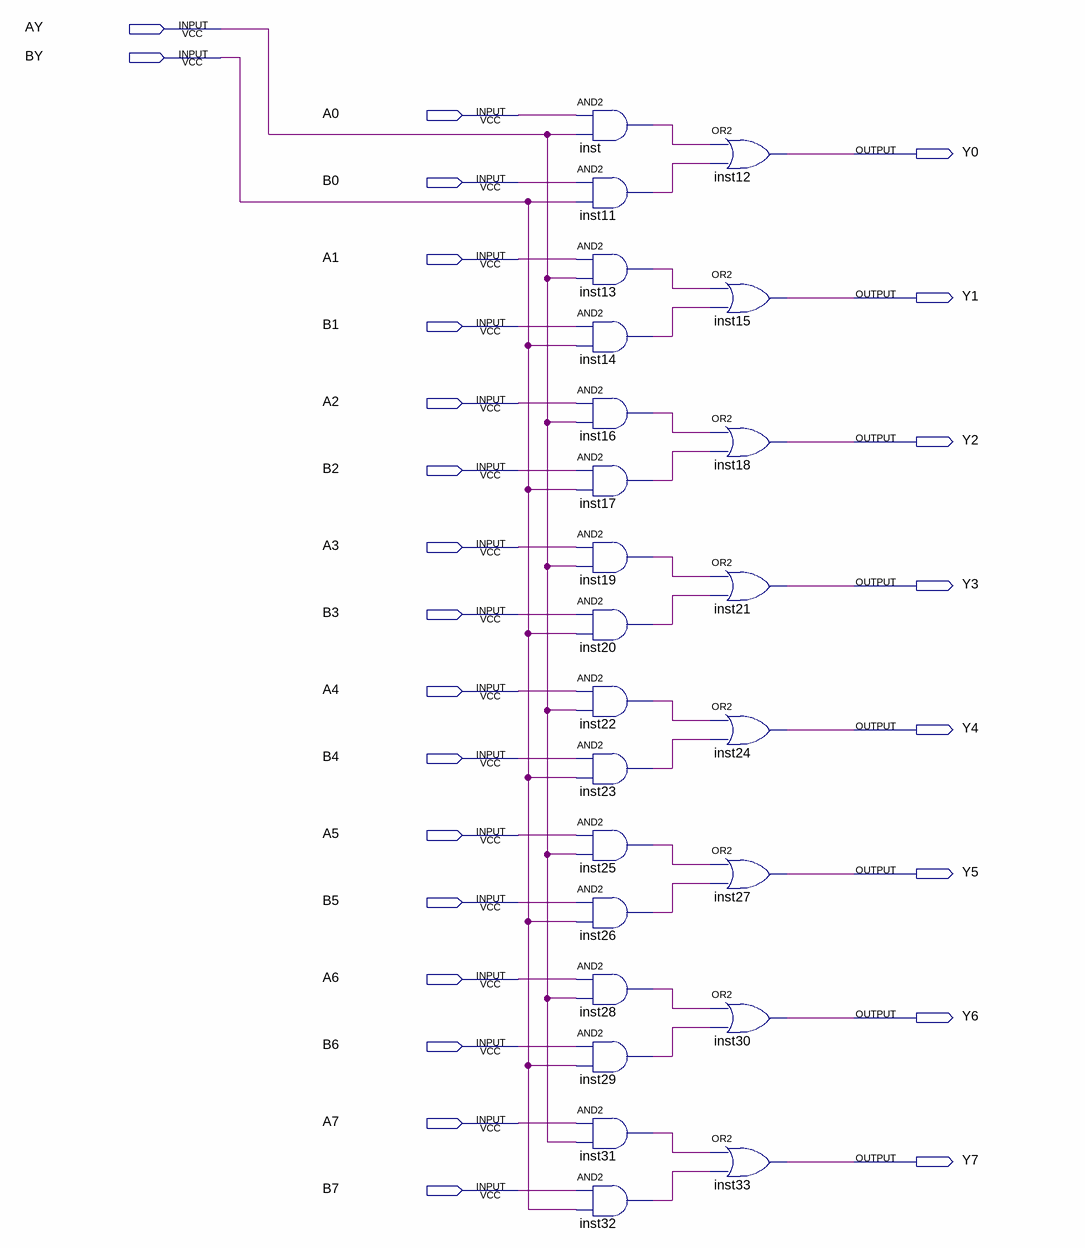
[diagram p0: schematic sheet]
// Quartus schematic data-8-selection-2-1.bdf as structural Verilog: 24 symbols, 26 pins
module \data-8-selection-2-1  (
  input  AY,
  input  BY,
  input  A0,
  input  B0,
  input  A1,
  input  B1,
  input  A2,
  input  B2,
  input  A3,
  input  B3,
  input  A4,
  input  B4,
  input  A5,
  input  B5,
  input  A6,
  input  B6,
  input  A7,
  input  B7,
  output Y0,
  output Y1,
  output Y2,
  output Y3,
  output Y4,
  output Y5,
  output Y6,
  output Y7
);

  wire inst11_out, inst13_out, inst14_out, inst16_out, inst17_out, inst19_out, inst20_out, inst22_out,
       inst23_out, inst25_out, inst26_out, inst28_out, inst29_out, inst31_out, inst32_out, inst_out;

  and inst (inst_out, A0, AY);
  and inst11 (inst11_out, B0, BY);
  and inst13 (inst13_out, A1, AY);
  and inst14 (inst14_out, B1, BY);
  and inst16 (inst16_out, A2, AY);
  and inst17 (inst17_out, B2, BY);
  and inst19 (inst19_out, A3, AY);
  and inst20 (inst20_out, B3, BY);
  and inst22 (inst22_out, A4, AY);
  and inst23 (inst23_out, B4, BY);
  and inst25 (inst25_out, A5, AY);
  and inst26 (inst26_out, B5, BY);
  and inst28 (inst28_out, A6, AY);
  and inst29 (inst29_out, B6, BY);
  and inst31 (inst31_out, A7, AY);
  and inst32 (inst32_out, B7, BY);
  or inst12 (Y0, inst_out, inst11_out);
  or inst15 (Y1, inst13_out, inst14_out);
  or inst18 (Y2, inst16_out, inst17_out);
  or inst21 (Y3, inst19_out, inst20_out);
  or inst24 (Y4, inst22_out, inst23_out);
  or inst27 (Y5, inst25_out, inst26_out);
  or inst30 (Y6, inst28_out, inst29_out);
  or inst33 (Y7, inst31_out, inst32_out);
endmodule
